# Altium project 20240828_VisitingCard.PrjPcb
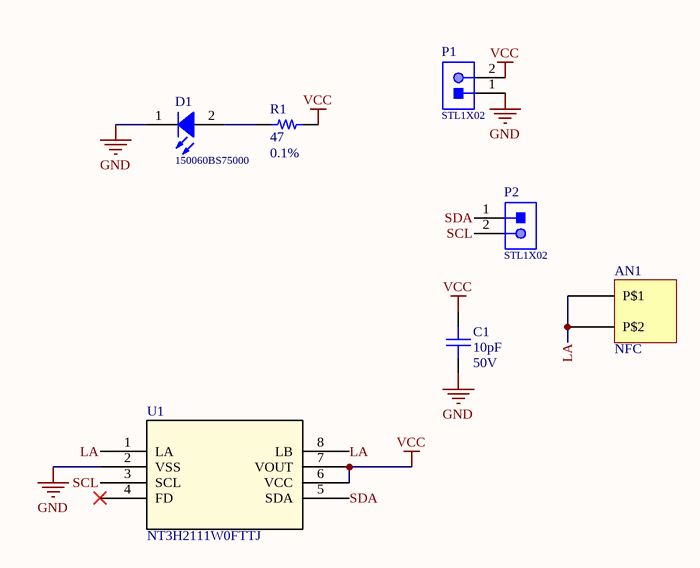
[diagram p0: main.SchDoc]
1 sheet, 7 parts. Net scope: global (net labels, ports and power ports of the same name join across sheets).
Board file: 20240828_VC_MM.PcbDoc

## Sheet main.SchDoc
size A4; SheetNumber: 1; SheetTotal: 1

### Parts
AN1  NFC  [NFC_Antenna]
C1  value 10pF  Voltage Rating: 50V  [FP-CL10-IPC_A]  (hidden comment: CC0603JRNPO9BN100)
D1  150060BS75000  [WL-SMCW_0603_H=0.7mm]
P1  STL1X02  [TSW-102-07-XXX-S]
P2  STL1X02  [TSW-102-07-XXX-S]
R1  value 47  Tolerance: 0.1%  [RESC1608X06N 0603 Medium Density]  (hidden comment: RG1608P-470-B-T5)
U1  NT3H2111W0FTTJ  [TSSOP_1W0FTTJ_NXP]

### Nets
GND: C1.1 D1.1(K) P1.1 U1.2(VSS)
VCC: C1.2 P1.2 R1.2 U1.6(VCC) U1.7(VOUT)
LA: AN1.P$1 AN1.P$2 U1.1(LA) U1.8(LB)
SCL: P2.2 U1.3(SCL)
SDA: P2.1 U1.5(SDA)
NetD1_2: D1.2(A) R1.1

Not connected (* = marked no-connect by the designer): U1 4(FD)*

### Library data of the parts
AN1 = antenna
C1 = CMP-001-00012-12: CAP, MLCC, C0G/NP0, 10PF, 50V,0603; Tolerance: 5%; Insulation Resistance: 100GR; Temperature Coefficient: 30ppm/°C; Dielectric: C0G; Termination: SMD/SMT; Capacitance: 10pF; Max Operating Temperature: 125°C; Length: 1.6mm; Case Code (Imperial): 0603; Radiation Hardening: No; Package Quantity: 1; Case Code (Metric): 1608; Series: CC; Voltage Rating (DC): 50V; Packaging: Tape and Reel; REACH SVHC: No SVHC; Thickness: 0.035inch; Depth: 0.8mm; RoHS Compliant: Yes; Lead Free: Lead Free; Resistor Type: Ceramic; Min Operating Temperature: -55°C; Case/Package: 0603; Voltage: 50V; Width: 0.031inch; Number of Pins: 2; Mount: Surface Mount; Height: 0.8mm
D1 = CMP-029-000002-2: WL-SMCW SMT Mono-color Chip LED Waterclear, size 0603, Blue, 3.2V, 140deg; Peak Wavelength typ.: 465nm; Luminous Intensity typ.: 145mcd; Dominant Wavelength typ.: 470nm; Chip Technology: InGaN; Source: WL-SMCW_0603.SchLib; Part Number: 150060BS75000; Forward Voltage typ.: 3.2V; ComponentLink2URL: https://www.we-online.com/catalog/datasheet/150060BS75000.pdf; Design Item ID: 150060BS75000; Operating Temperature: -40 to +85degC; ComponentLink1URL: http://www.we-online.de; ComponentLink1Description: Manufacturer; Viewing Angle: 140deg; Publisher: Wurth Elektronik; ComponentLink2Description: Datasheet; Mounting Technology: SMT; Published Date: December 2019; Packaging: Tape and Reel; Emitting Color: Blue; Size: 0603
P1 P2 = CMP-061-000008-4: Stiftleiste, 2-Pin; Pin Count: 2; Source: Pin_Header.SchLib; Design Item ID: STL1X02; Component Type: Standard
R1 = CMP-009-00043-3: Thin Film Resistors - SMD 1/10W 47h Ohms 0.1% 0603 25ppm; Max Power Dissipation: 100mW; Temperature Coefficient: 25ppm/°C; Resistance: 47R; Power Rating: 62.5mW; Voltage Rating (DC): 75V; Working Voltage: 100V; Resistor Type: Thin Film; Width: 0.8mm; Features: Automotive AEC-Q200,Anti-Sulfur; Length: 1.6mm; Military Standard: Not; Height: 0.4mm; Series: RG; Construction: Rectangular; Number of Terminations: 2; Voltage Rating: 75V; Technology: THIN FILM; Packaging: Tape and Reel; Lead Free: Lead Free; Case/Package: 0603; Case Code (Imperial): 0603; Case Code (Metric): 1608; Weight: 7.1E-05oz; Depth: 0.8mm; RoHS Compliant: Yes; Package Quantity: 5000; Min Operating Temperature: -55°C; Termination: SMD/SMT; Max Operating Temperature: 155°C; Size Code: 0603
U1 = NT3H2111W0FTTJ: No Description Available; Mfr_Name: NXP; RefDes: RefDes; Type: Type